# EAGLE schematic Nixie Clock (EAGLE 9.6.2)

## Sheet 1 of 5: Microcontroller
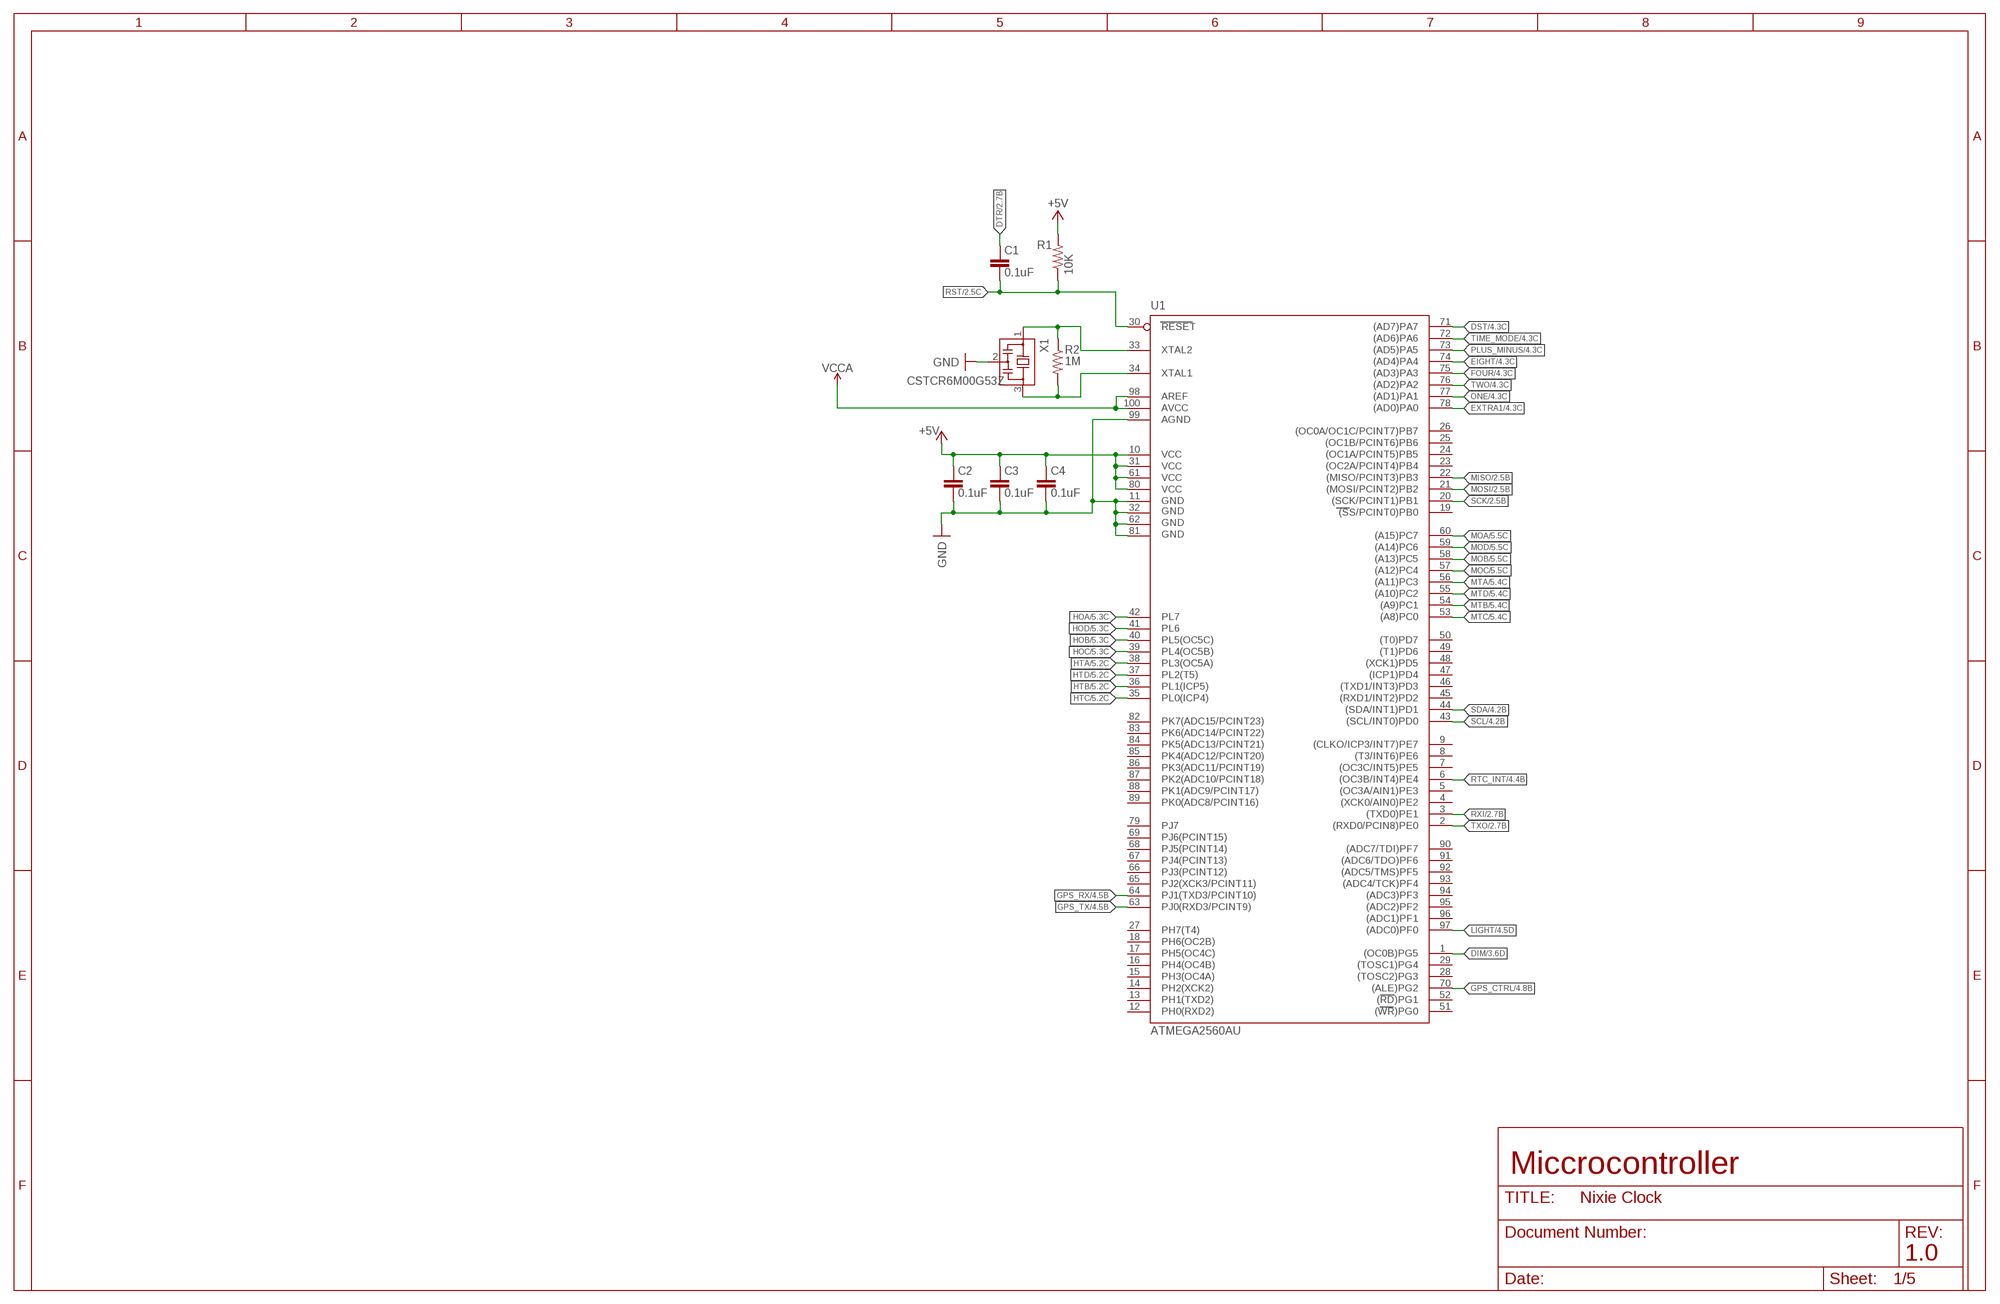
[diagram p0: schematic, sheet 1]

### Parts
C1  0.1uF  C-EUC0603  [C0603]
C2  0.1uF  C-EUC0603  [C0603]
C3  0.1uF  C-EUC0603  [C0603]
C4  0.1uF  C-EUC0603  [C0603]
R1  10K  R-US_R0603  [R0603]
R2  1M  R-US_R0603  [R0603]
U1  ATMEGA2560AU  [TQFP100]
X1  CSTCR6M00G53Z  [CSTCR6M]

### Nets
+5V: C2.1 C3.1 C4.1 R1.2 U1.10(VCC) U1.31(VCC1) U1.61(VCC2) U1.80(VCC3) ; also sheet 2,3,4,5
DIM: U1.1((OC0B)PG5) ; also sheet 3
DST: U1.71((AD7)PA7) ; also sheet 4
DTR: C1.1 ; also sheet 2
EIGHT: U1.74((AD4)PA4) ; also sheet 4
EXTRA1: U1.78((AD0)PA0) ; also sheet 4
FOUR: U1.75((AD3)PA3) ; also sheet 4
GND: C2.2 C3.2 C4.2 U1.11(GND) U1.32(GND1) U1.62(GND2) U1.81(GND3) U1.99(AGND) X1.2 ; also sheet 2,3,4,5
GPS_CTRL: U1.70((ALE)PG2) ; also sheet 4
GPS_RX: U1.64(PJ1(TXD3/PCINT10)) ; also sheet 4
GPS_TX: U1.63(PJ0(RXD3/PCINT9)) ; also sheet 4
HOA: U1.42(PL7) ; also sheet 5
HOB: U1.40(PL5(OC5C)) ; also sheet 5
HOC: U1.39(PL4(OC5B)) ; also sheet 5
HOD: U1.41(PL6) ; also sheet 5
HTA: U1.38(PL3(OC5A)) ; also sheet 5
HTB: U1.36(PL1(ICP5)) ; also sheet 5
HTC: U1.35(PL0(ICP4)) ; also sheet 5
HTD: U1.37(PL2(T5)) ; also sheet 5
LIGHT: U1.97((ADC0)PF0) ; also sheet 4
MISO: U1.22((MISO/PCINT3)PB3) ; also sheet 2
MOA: U1.60((A15)PC7) ; also sheet 5
MOB: U1.58((A13)PC5) ; also sheet 5
MOC: U1.57((A12)PC4) ; also sheet 5
MOD: U1.59((A14)PC6) ; also sheet 5
MOSI: U1.21((MOSI/PCINT2)PB2) ; also sheet 2
MTA: U1.56((A11)PC3) ; also sheet 5
MTB: U1.54((A9)PC1) ; also sheet 5
MTC: U1.53((A8)PC0) ; also sheet 5
MTD: U1.55((A10)PC2) ; also sheet 5
N$60: R2.2 U1.34(XTAL1) X1.3
N$61: R2.1 U1.33(XTAL2) X1.1
ONE: U1.77((AD1)PA1) ; also sheet 4
PLUS_MINUS: U1.73((AD5)PA5) ; also sheet 4
RST: C1.2 R1.1 U1.30(RESET) ; also sheet 2
RTC_INT: U1.6((OC3B/INT4)PE4) ; also sheet 4
RXI: U1.3((TXD0)PE1) ; also sheet 2
SCK: U1.20((SCK/PCINT1)PB1) ; also sheet 2
SCL: U1.43((SCL/INT0)PD0) ; also sheet 4
SDA: U1.44((SDA/INT1)PD1) ; also sheet 4
TIME_MODE: U1.72((AD6)PA6) ; also sheet 4
TWO: U1.76((AD2)PA2) ; also sheet 4
TXO: U1.2((RXD0/PCIN8)PE0) ; also sheet 2
VCCA: U1.98(AREF) U1.100(AVCC) ; also sheet 3,4
Unconnected: U1.4((XCK0/AIN0)PE2) U1.5((OC3A/AIN1)PE3) U1.7((OC3C/INT5)PE5) U1.8((T3/INT6)PE6) U1.9((CLKO/ICP3/INT7)PE7) U1.12(PH0(RXD2)) U1.13(PH1(TXD2)) U1.14(PH2(XCK2)) U1.15(PH3(OC4A)) U1.16(PH4(OC4B)) U1.17(PH5(OC4C)) U1.18(PH6(OC2B)) U1.19((SS/PCINT0)PB0) U1.23((OC2A/PCINT4)PB4) U1.24((OC1A/PCINT5)PB5) U1.25((OC1B/PCINT6)PB6) U1.26((OC0A/OC1C/PCINT7)PB7) U1.27(PH7(T4)) U1.28((TOSC2)PG3) U1.29((TOSC1)PG4) U1.45((RXD1/INT2)PD2) U1.46((TXD1/INT3)PD3) U1.47((ICP1)PD4) U1.48((XCK1)PD5) U1.49((T1)PD6) U1.50((T0)PD7) U1.51((WR)PG0) U1.52((RD)PG1) U1.65(PJ2(XCK3/PCINT11)) U1.66(PJ3(PCINT12)) U1.67(PJ4(PCINT13)) U1.68(PJ5(PCINT14)) U1.69(PJ6(PCINT15)) U1.79(PJ7) U1.82(PK7(ADC15/PCINT23)) U1.83(PK6(ADC14/PCINT22)) U1.84(PK5(ADC13/PCINT21)) U1.85(PK4(ADC12/PCINT20)) U1.86(PK3(ADC11/PCINT19)) U1.87(PK2(ADC10/PCINT18)) U1.88(PK1(ADC9/PCINT17)) U1.89(PK0(ADC8/PCINT16)) U1.90((ADC7/TDI)PF7) U1.91((ADC6/TDO)PF6) U1.92((ADC5/TMS)PF5) U1.93((ADC4/TCK)PF4) U1.94((ADC3)PF3) U1.95((ADC2)PF2) U1.96((ADC1)PF1)

### Notes on the sheet
- Miccrocontroller
- 1.0

## Sheet 2 of 5: Communication
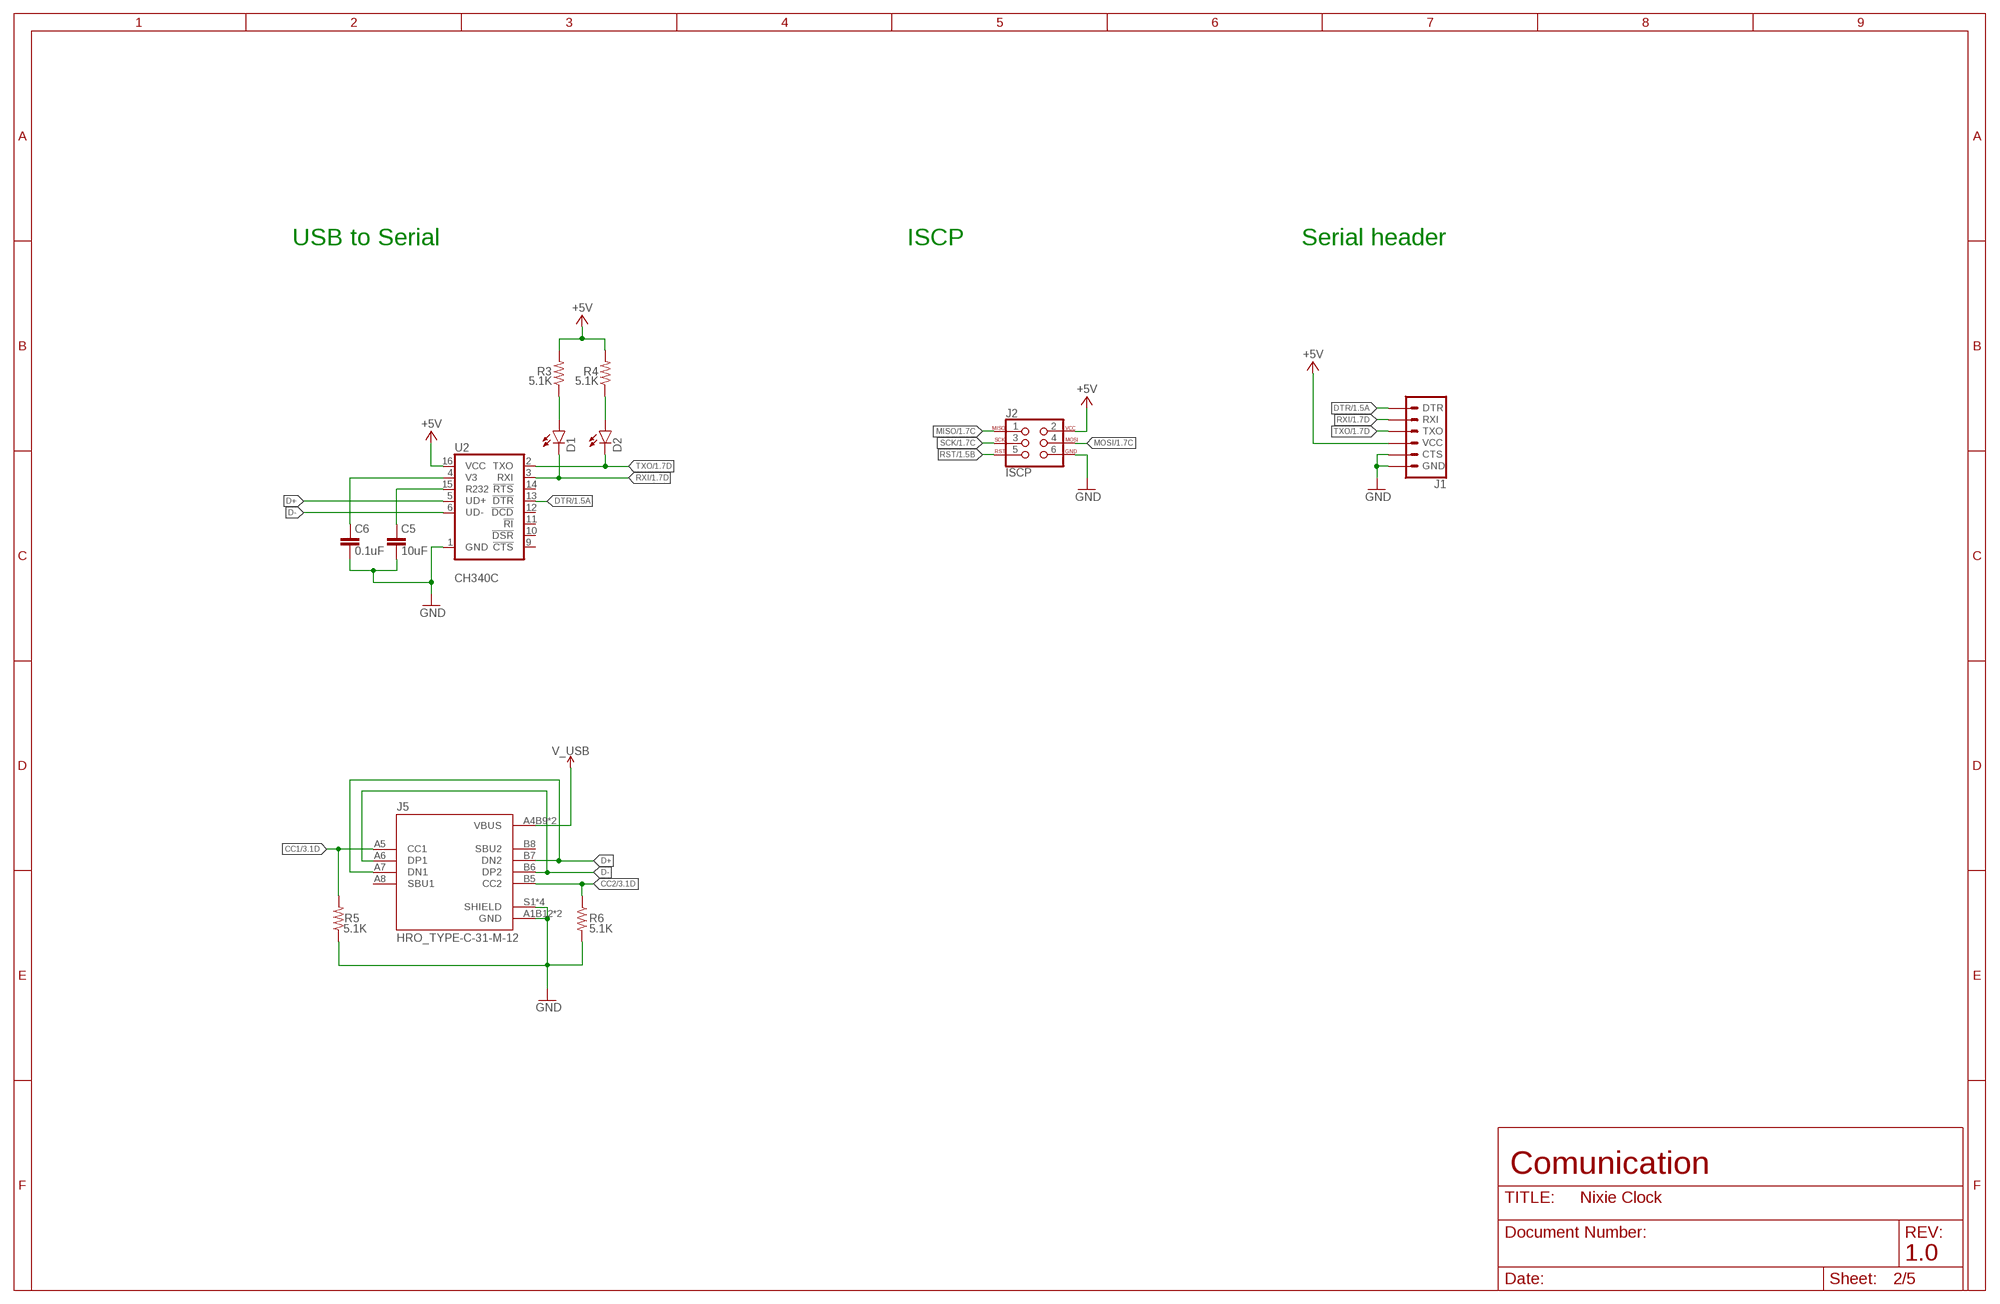
[diagram p1: schematic, sheet 2]

### Parts
C5  10uF  C-EUC0603  [C0603]
C6  0.1uF  C-EUC0603  [C0603]
D1  LEDCHIP-LED0603  [CHIP-LED0603]
D2  LEDCHIP-LED0603  [CHIP-LED0603]
J1  6_PIN_SERIAL_TARGETSILK  [6_PIN_SERIAL_TARGET_SIDE_W_SILK]
J2  ISCP  AVR_SPI_PROG_3X2PTH  [2X3]
J5  HRO_TYPE-C-31-M-12  [HRO_TYPE-C-31-M-12]
R3  5.1K  R-US_R0603  [R0603]
R4  5.1K  R-US_R0603  [R0603]
R5  5.1K  R-US_R0603  [R0603]
R6  5.1K  R-US_R0603  [R0603]
U2  CH340C  [SO016]

### Nets
+5V: J1.P$4(VCC) J2.2 R3.2 R4.2 U2.16(VCC) ; also sheet 1,3,4,5
CC1: J5.A5(CC1) R5.2 ; also sheet 3
CC2: J5.B5(CC2) R6.1 ; also sheet 3
D+: J5.A7(DN1) J5.B7(DN2) U2.5(UD+)
D-: J5.A6(DP1) J5.B6(DP2) U2.6(UD-)
DTR: J1.P$1(DTR) U2.13(!DTR) ; also sheet 1
GND: C5.2 C6.2 J1.P$5(CTS) J1.P$6(GND) J2.6 J5.A1B12(GND) J5.B1A12(GND) J5.S1(SHIELD) J5.S2(SHIELD) J5.S3(SHIELD) J5.S4(SHIELD) R5.1 R6.2 U2.1(GND) ; also sheet 1,3,4,5
MISO: J2.1 ; also sheet 1
MOSI: J2.4 ; also sheet 1
N$1: C5.1 U2.15(R232)
N$2: C6.1 U2.4(V3)
N$8: D1.A R3.1
N$9: D2.A R4.1
RST: J2.5 ; also sheet 1
RXI: D1.C J1.P$3(RXI) U2.3(RXI) ; also sheet 1
SCK: J2.3 ; also sheet 1
TXO: D2.C J1.P$2(TXO) U2.2(TXO) ; also sheet 1
V_USB: J5.A4B9(VBUS) J5.B4A9(VBUS) ; also sheet 3
Unconnected: J5.A8(SBU1) J5.B8(SBU2) U2.9(!CTS) U2.10(!DSR) U2.11(!RI) U2.12(!DCD) U2.14(!RTS)

### Notes on the sheet
- USB to Serial | ISCP | Serial header
- Comunication
- 1.0

## Sheet 3 of 5: Power
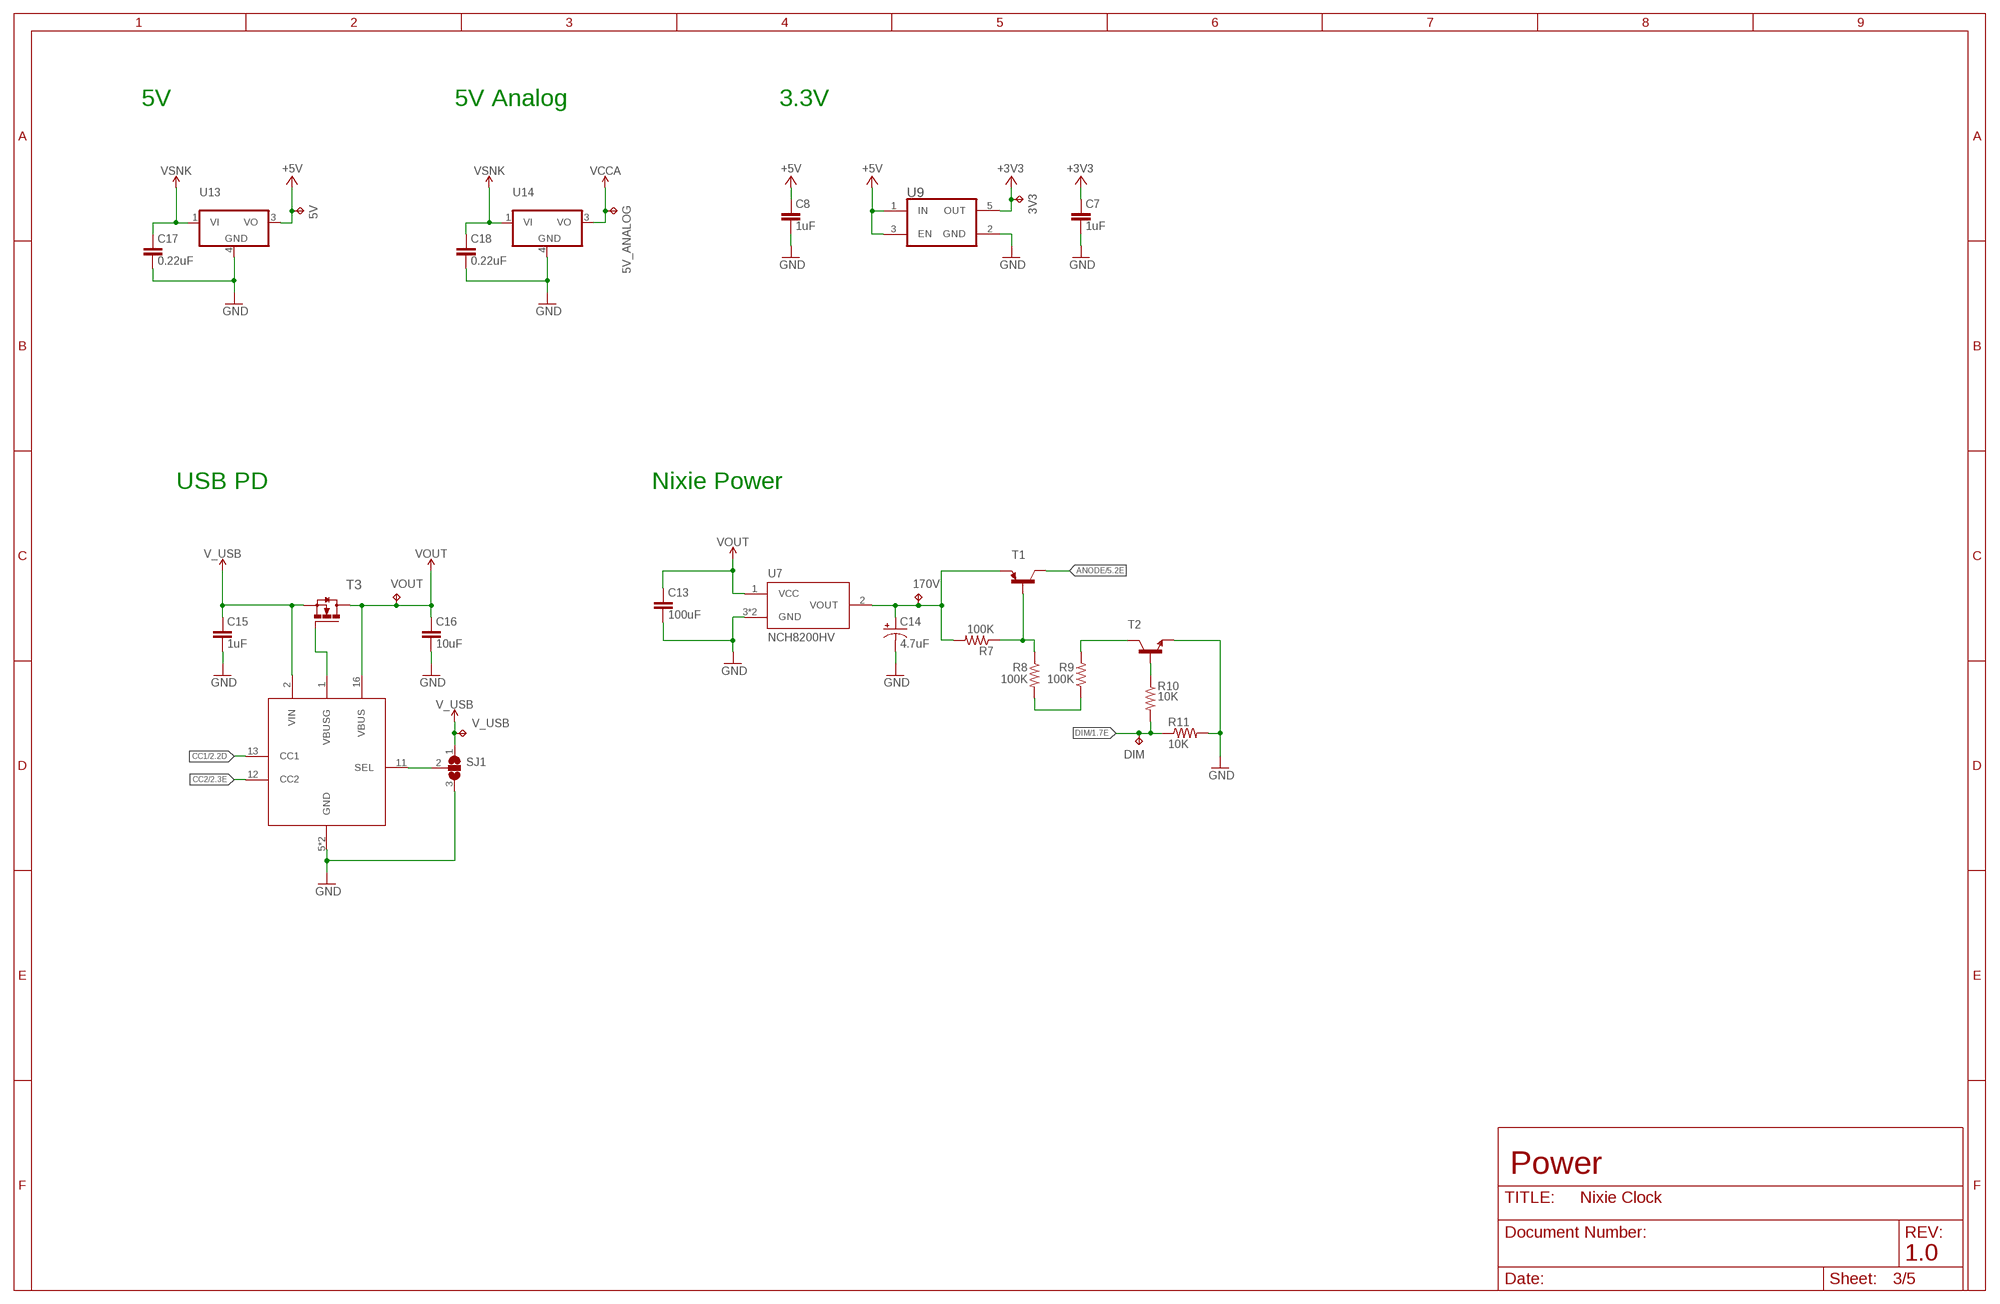
[diagram p2: schematic, sheet 3]

### Parts
3V3  TPPAD1-13  [P1-13]
5V  TPPAD1-13  [P1-13]
5V_ANALOG  TPPAD1-13  [P1-13]
170V  TPPAD1-13  [P1-13]
C7  1uF  C-EUC0603  [C0603]
C8  1uF  C-EUC0603  [C0603]
C13  100uF  C-EUC0603  [C0603]
C14  4.7uF  CPOL-USE3.5-8  [E3,5-8]
C15  1uF  C-EUC0603  [C0603]
C16  10uF  C-EUC0603  [C0603]
C17  0.22uF  C-EUC0603  [C0603]
C18  0.22uF  C-EUC0603  [C0603]
DIM  TPPAD1-13  [P1-13]
R7  100K  R-US_R0603  [R0603]
R8  100K  R-US_R0603  [R0603]
R9  100K  R-US_R0603  [R0603]
R10  10K  R-US_R0603  [R0603]
R11  10K  R-US_R0603  [R0603]
SJ1  SJ2W  [SJ_2]
T1  PZTA92  [SOT223]
T2  PZTA42  [SOT223]
T3  CSD18543Q3A  [VSONP-8]
U7  NCH8200HV  [NCH8200HV]
U9  MIC5504-3.3YM5TR  [SOT95P280X130-5N]
U12  IP2721  [TSSOP16EXP]
U13  LM340MP-05  [SOT223]
U14  LM340MP-05  [SOT223]
V_USB  TPPAD1-13  [P1-13]
VOUT  TPPAD1-13  [P1-13]

### Nets
+3V3: 3V3.TP C7.1 U9.5(OUT) ; also sheet 4
+5V: 5V.TP C8.1 U9.1(IN) U9.3(EN) U13.3(VO) ; also sheet 1,2,4,5
ANODE: T1.2(C) T1.4(C) ; also sheet 5
CC1: U12.13(CC1) ; also sheet 2
CC2: U12.12(CC2) ; also sheet 2
DIM: DIM.TP R10.2 R11.1 ; also sheet 1
GND: C7.2 C8.2 C13.2 C14.- C15.2 C16.2 C17.2 C18.2 R11.2 SJ1.3 T2.3(E) U7.3(GND) U7.4(GND) U9.2(GND) U12.5(GND) U12.EXP(GND) U13.4(GND) U14.4(GND) ; also sheet 1,2,4,5
N$3: T3.4(G) U12.1(VBUSG)
N$4: SJ1.2 U12.11(SEL)
N$6: R10.1 T2.1(B)
N$51: 170V.TP C14.+ R7.2 T1.3(E) U7.2(VOUT)
N$53: R7.1 R8.1 T1.1(B)
N$63: R9.2 T2.2(C) T2.4(C)
N$64: R8.2 R9.1
V_USB: C15.1 SJ1.1 T3.1(S) T3.2(S) T3.3(S) U12.2(VIN) V_USB.TP ; also sheet 2
VCCA: 5V_ANALOG.TP U14.3(VO) ; also sheet 1,4
VOUT: C13.1 C16.1 C17.1 C18.1 T3.5(D) T3.6(D) T3.7(D) T3.8(D) T3.9(D) T3.10(D) T3.11(D) T3.12(D) U7.1(VCC) U12.16(VBUS) U13.1(VI) U14.1(VI) VOUT.TP ; supply symbol labelled VSNK

### Notes on the sheet
- 5V | 5V Analog | 3.3V
- USB PD | Nixie Power
- Power
- 1.0

## Sheet 4 of 5: RTC and GPS
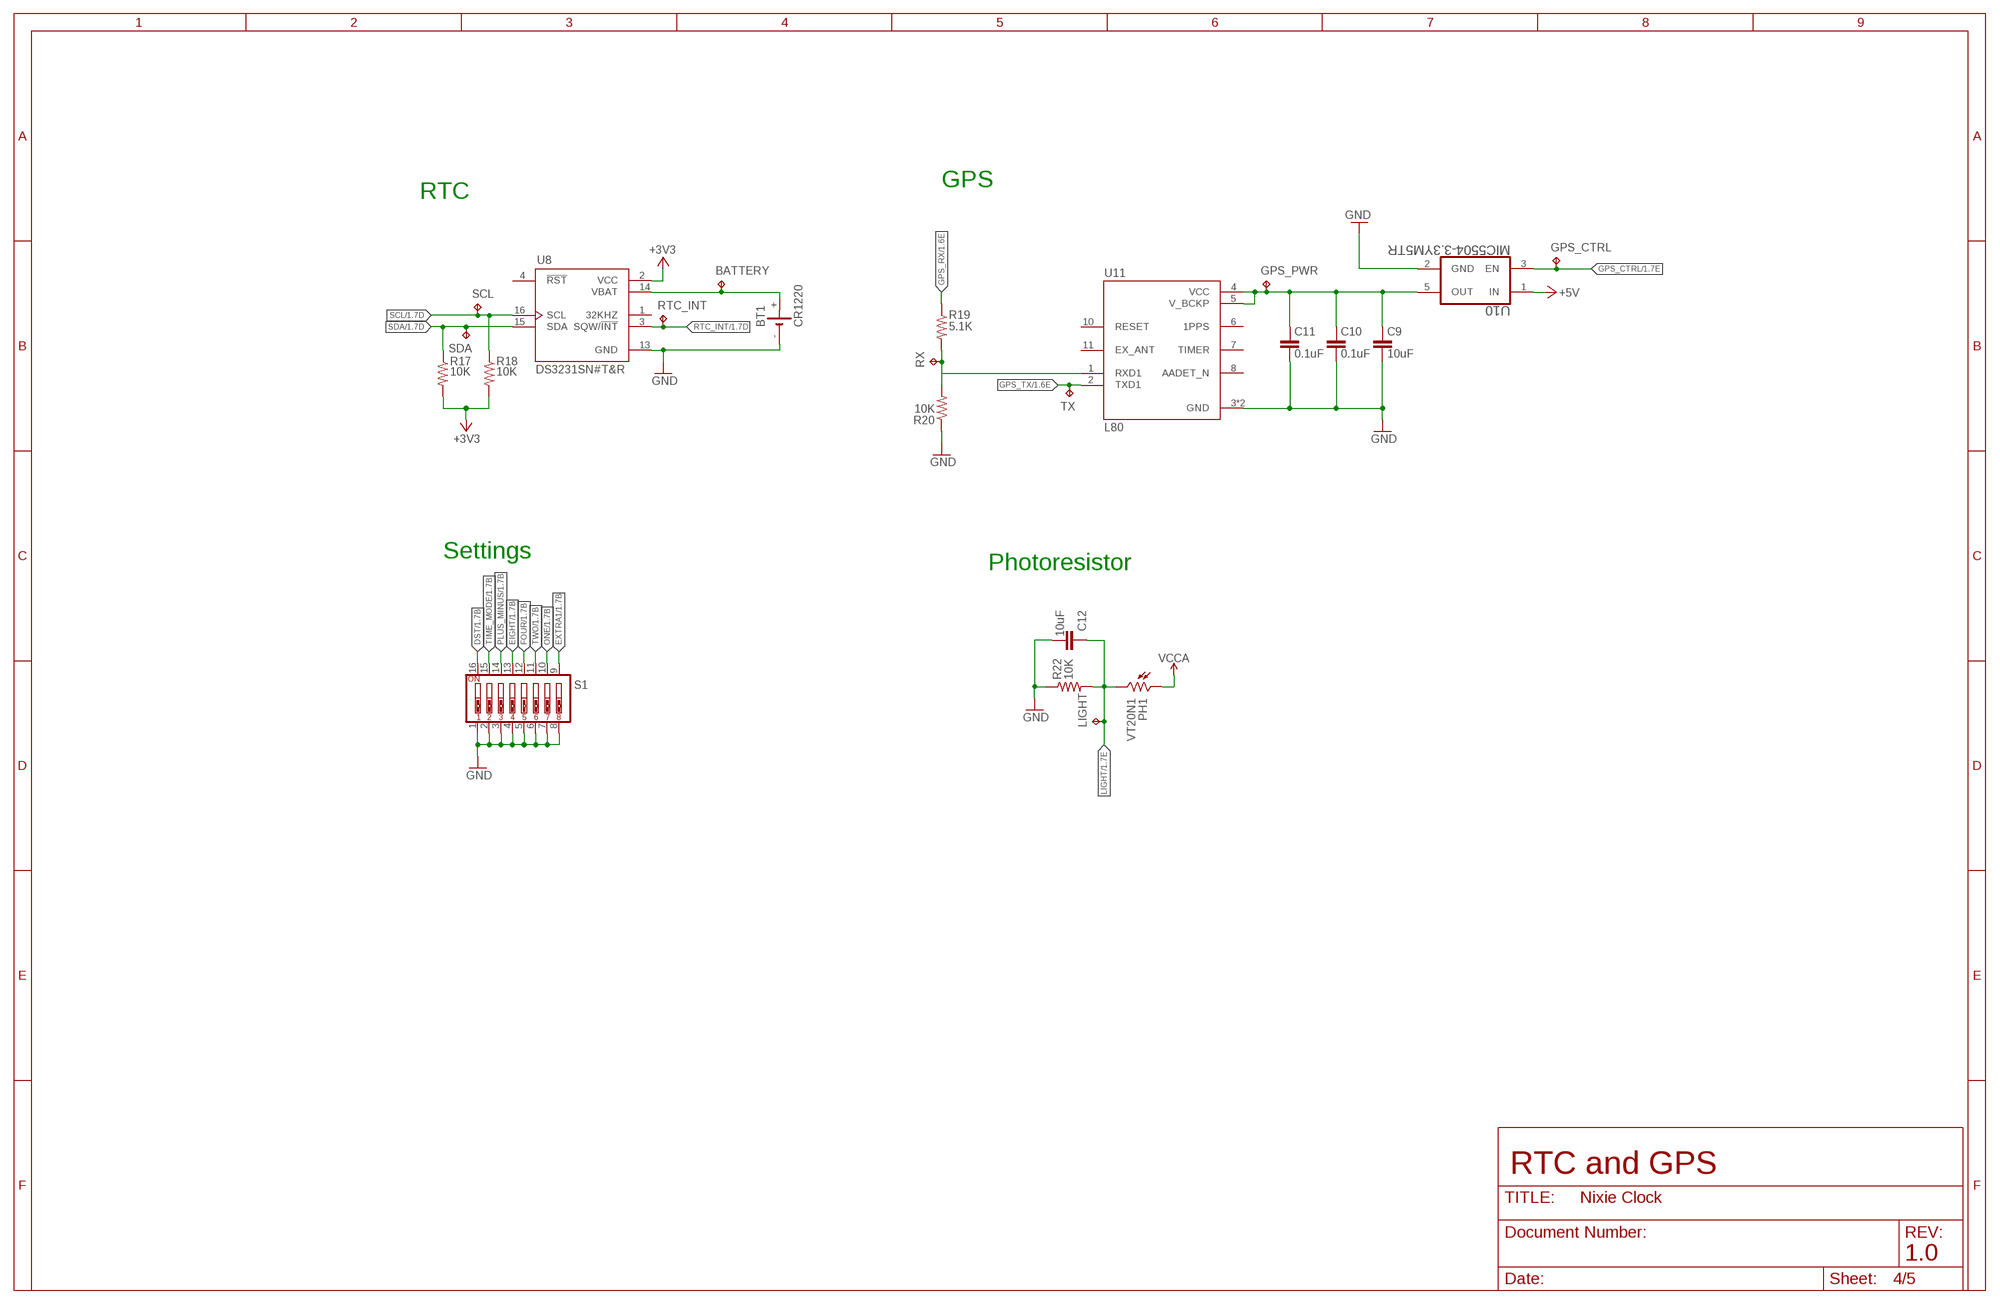
[diagram p3: schematic, sheet 4]

### Parts
BATTERY  TPPAD1-13  [P1-13]
BT1  CR1220  CH291-1220LF  [CH291-1220LF]
C9  10uF  C-EUC0603  [C0603]
C10  0.1uF  C-EUC0603  [C0603]
C11  0.1uF  C-EUC0603  [C0603]
C12  10uF  C-EUC0603  [C0603]
GPS_CTRL  TPPAD1-13  [P1-13]
GPS_PWR  TPPAD1-13  [P1-13]
LIGHT  TPPAD1-13  [P1-13]
PH1  VT20N1  [TO46-VT200]
R17  10K  R-US_R0603  [R0603]
R18  10K  R-US_R0603  [R0603]
R19  5.1K  R-US_R0603  [R0603]
R20  10K  R-US_R0603  [R0603]
R22  10K  R-US_R0603  [R0603]
RTC_INT  TPPAD1-13  [P1-13]
RX  TPPAD1-13  [P1-13]
S1  SW_DIP-8  [EDG-08]
SCL  TPPAD1-13  [P1-13]
SDA  TPPAD1-13  [P1-13]
TX  TPPAD1-13  [P1-13]
U8  DS3231SN#T&R  [SOIC127P1032X265-16N]
U10  MIC5504-3.3YM5TR  [SOT95P280X130-5N]
U11  L80  [XCVR_L80]

### Nets
+3V3: R17.2 R18.2 U8.2(VCC) ; also sheet 3
+5V: U10.1(IN) ; also sheet 1,2,3,5
DST: S1.16 ; also sheet 1
EIGHT: S1.13 ; also sheet 1
EXTRA1: S1.9 ; also sheet 1
FOUR: S1.12 ; also sheet 1
GND: BT1.- C9.2 C10.2 C11.2 C12.2 R20.1 R22.1 S1.1 S1.2 S1.3 S1.4 S1.5 S1.6 S1.7 S1.8 U8.13(GND) U10.2(GND) U11.3(GND) U11.12(GND) ; also sheet 1,2,3,5
GPS_CTRL: GPS_CTRL.TP U10.3(EN) ; also sheet 1
GPS_RX: R19.1 ; also sheet 1
GPS_TX: TX.TP U11.2(TXD1) ; also sheet 1
LIGHT: C12.1 LIGHT.TP PH1.2 R22.2 ; also sheet 1
N$55: BATTERY.TP BT1.+ U8.14(VBAT)
N$56: C9.1 C10.1 C11.1 GPS_PWR.TP U10.5(OUT) U11.4(VCC) U11.5(V_BCKP)
N$57: R19.2 R20.2 RX.TP U11.1(RXD1)
ONE: S1.10 ; also sheet 1
PLUS_MINUS: S1.14 ; also sheet 1
RTC_INT: RTC_INT.TP U8.3(SQW/!INT) ; also sheet 1
SCL: R18.1 SCL.TP U8.16(SCL) ; also sheet 1
SDA: R17.1 SDA.TP U8.15(SDA) ; also sheet 1
TIME_MODE: S1.15 ; also sheet 1
TWO: S1.11 ; also sheet 1
VCCA: PH1.1 ; also sheet 1,3
Unconnected: U8.1(32KHZ) U8.4(!RST) U11.6(1PPS) U11.7(TIMER) U11.8(AADET_N) U11.10(RESET) U11.11(EX_ANT)

### Notes on the sheet
- GPS
- RTC
- Settings
- Photoresistor
- RTC and GPS
- 1.0

## Sheet 5 of 5: Nixie Tubes and Drivers
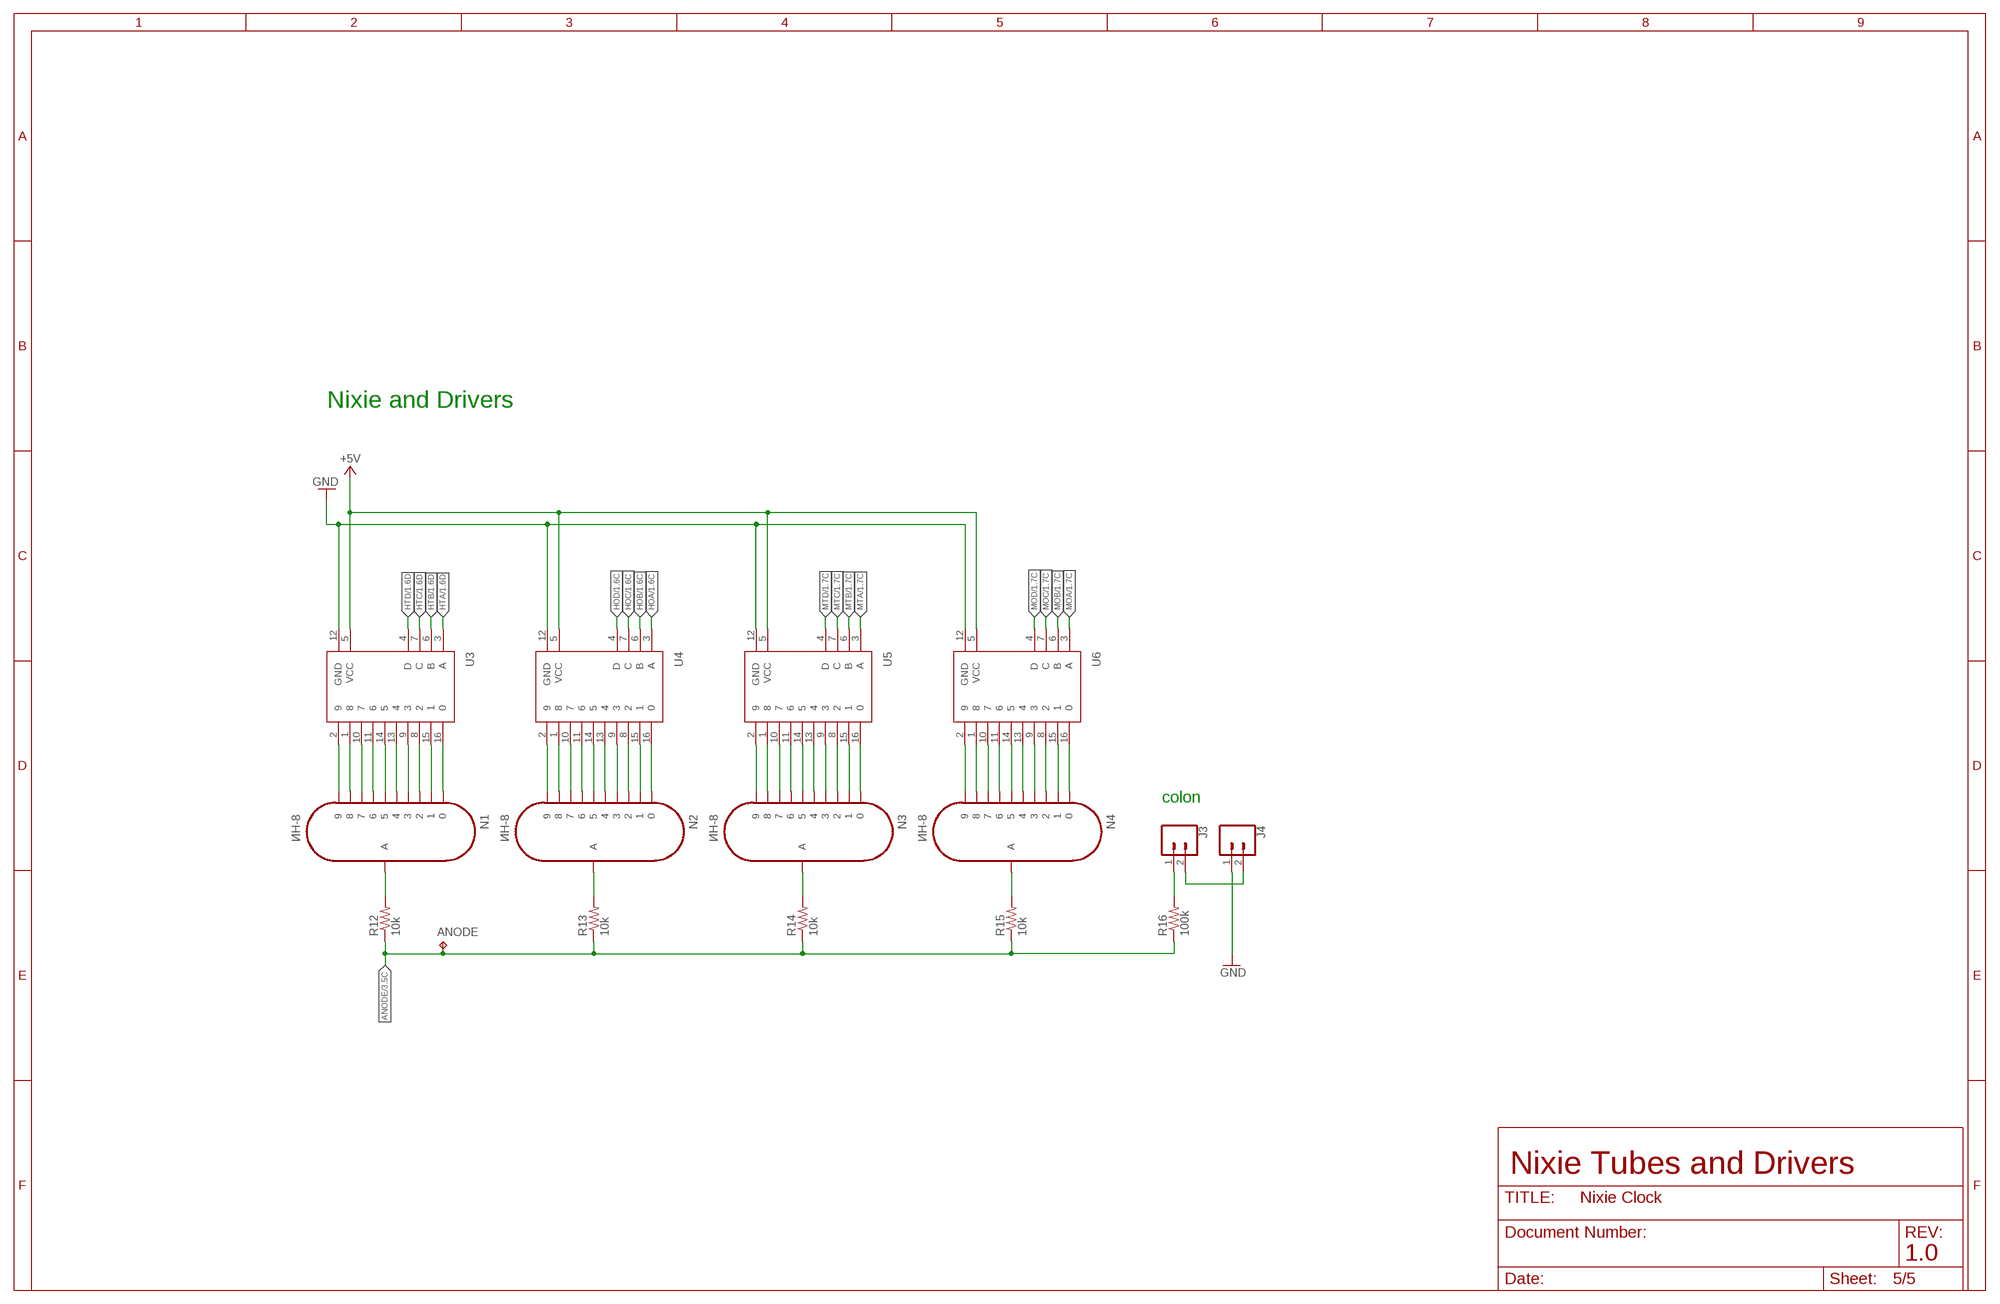
[diagram p4: schematic, sheet 5]

### Parts
ANODE  TPPAD1-13  [P1-13]
J3  CONN_02LOCK_LONGPADS  [1X02_LOCK_LONGPADS]
J4  CONN_02LOCK_LONGPADS  [1X02_LOCK_LONGPADS]
N1  ИН-8  IN-8IN-8_SOCKET  [IN-8_SOCKET]
N2  ИН-8  IN-8IN-8_SOCKET  [IN-8_SOCKET]
N3  ИН-8  IN-8IN-8_SOCKET  [IN-8_SOCKET]
N4  ИН-8  IN-8IN-8_SOCKET  [IN-8_SOCKET]
R12  10k  R-US_M0805  [M0805]
R13  10k  R-US_M0805  [M0805]
R14  10k  R-US_M0805  [M0805]
R15  10k  R-US_M0805  [M0805]
R16  100k  R-US_R0603  [R0603]
U3  K155ID1  [DIL16-KIT]
U4  K155ID1  [DIL16-KIT]
U5  K155ID1  [DIL16-KIT]
U6  K155ID1  [DIL16-KIT]

### Nets
+5V: U3.5(VCC) U4.5(VCC) U5.5(VCC) U6.5(VCC) ; also sheet 1,2,3,4
ANODE: ANODE.TP R12.1 R13.1 R14.1 R15.1 R16.1 ; also sheet 3
GND: J4.1 U3.12(GND) U4.12(GND) U5.12(GND) U6.12(GND) ; also sheet 1,2,3,4
HOA: U4.3(A) ; also sheet 1
HOB: U4.6(B) ; also sheet 1
HOC: U4.7(C) ; also sheet 1
HOD: U4.4(D) ; also sheet 1
HTA: U3.3(A) ; also sheet 1
HTB: U3.6(B) ; also sheet 1
HTC: U3.7(C) ; also sheet 1
HTD: U3.4(D) ; also sheet 1
MOA: U6.3(A) ; also sheet 1
MOB: U6.6(B) ; also sheet 1
MOC: U6.7(C) ; also sheet 1
MOD: U6.4(D) ; also sheet 1
MTA: U5.3(A) ; also sheet 1
MTB: U5.6(B) ; also sheet 1
MTC: U5.7(C) ; also sheet 1
MTD: U5.4(D) ; also sheet 1
N$5: J3.1 R16.2
N$7: J3.2 J4.2
N$16: N1.9 U3.2
N$17: N1.8 U3.1
N$18: N1.7 U3.10
N$19: N1.6 U3.11
N$20: N1.5 U3.14
N$21: N1.4 U3.13
N$22: N1.3 U3.9
N$23: N1.2 U3.8
N$24: N1.1 U3.15
N$25: N1.0 U3.16
N$26: N1.A R12.2
N$27: N2.9 U4.2
N$28: N2.8 U4.1
N$29: N2.7 U4.10
N$30: N2.6 U4.11
N$31: N2.5 U4.14
N$32: N2.4 U4.13
N$33: N2.3 U4.9
N$34: N2.2 U4.8
N$35: N2.1 U4.15
N$36: N2.0 U4.16
N$37: N2.A R13.2
N$62: N3.9 U5.2
N$65: N3.8 U5.1
N$66: N3.7 U5.10
N$67: N3.6 U5.11
N$68: N3.5 U5.14
N$69: N3.4 U5.13
N$70: N3.3 U5.9
N$71: N3.2 U5.8
N$72: N3.1 U5.15
N$73: N3.0 U5.16
N$74: N3.A R14.2
N$86: N4.9 U6.2
N$87: N4.8 U6.1
N$88: N4.7 U6.10
N$89: N4.6 U6.11
N$90: N4.5 U6.14
N$91: N4.4 U6.13
N$92: N4.3 U6.9
N$93: N4.2 U6.8
N$94: N4.1 U6.15
N$95: N4.0 U6.16
N$96: N4.A R15.2

### Notes on the sheet
- Nixie and Drivers
- colon
- Nixie Tubes and Drivers
- 1.0

## Library data of the parts
3V3 5V 5V_ANALOG 170V ANODE BATTERY DIM GPS_CTRL GPS_PWR LIGHT RTC_INT RX SCL SDA TX V_USB VOUT = testpad:TP: Test pad
BT1 = battery:CH291-1220LF: Battery Holder, SMT, 12mm multicomp PART NO. CH291-1220LF Source: Data sheet <http://www.farnell.com/datasheets/1505860.pdf>
C1-C13 C15-C18 = rcl:C-EU: CAPACITOR, European symbol; SPICEPREFIX: C
C14 = rcl:CPOL-US: POLARIZED CAPACITOR, American symbol; SPICEPREFIX: C
D1 D2 = led:LED: LED OSRAM: - CHIPLED LG R971, LG N971, LY N971, LG Q971, LY Q971, LO R971, LY R971 LH N974, LH R974 LS Q976, LO Q976, LY Q976 LO Q996 - Hyper CHIPLED LW Q18S LB Q993, LB Q99A, LB R99A - SideLED LS A670, LO A670, LY A670, LG A670, LP A670 LB A673, LV A673, LT A673, LW A673 LH A674 LY A675 LS A676, LA A676, LO A676, LY A676, LW A676 LS A679, LY A679, LG A679 - Hyper Micro SIDELED® LS Y876, LA Y876, LO Y876, LY Y876 LT Y87S - SmartLED LW L88C, LW L88S LB L89C, LB L89S, LG L890 LS L89K, LO L89K, LY L89K LS L896, LA L896, LO L896, LY L896 - TOPLED LS T670, LO T670, LY T670, LG T670, LP T670 LSG T670, LSP T670, LSY T670, LOP T670, LYG T670 LG T671, LOG T671, LSG T671 LB T673, LV T673, LT T673, LW T673 LH T674 LS T676, LA T676, LO T676, LY T676, LB T676, LH T676, LSB T676, LW T676 LB T67C, LV T67C, LT T67C, LS T67K, LO T67K, LY T67K, LW E67C LS E67B, LA E67B, LO E67B, LY E67B, LB E67C, LV E67C, LT E67C LW T67C LS T679, LY T679, LG T679 LS T770, LO T770, LY T770, LG T770, LP T770 LB T773, LV T773, LT T773, LW T773 LH T774 LS E675, LA E675, LY E675, LS T675 LS T776, LA T776, LO T776, LY T776, LB T776 LHGB T686 LT T68C, LB T68C - Hyper Mini TOPLED® LB M676 - Mini TOPLED Santana® LG M470 LS M47K, LO M47K, LY M47K Source: http://www.osram.convergy.de LUXEON: - LUMILED® LXK2-PW12-R00, LXK2-PW12-S00, LXK2-PW14-U00, LXK2-PW14-V00 LXK2-PM12-R00, LXK2-PM12-S00, LXK2-PM14-U00 LXK2-PE12-Q00, LXK2-PE12-R00, LXK2-PE12-S00, LXK2-PE14-T00, LXK2-PE14-U00 LXK2-PB12-K00, LXK2-PB12-L00, LXK2-PB12-M00, LXK2-PB14-N00, LXK2-PB14-P00, LXK2-PB14-Q00 LXK2-PR12-L00, LXK2-PR12-M00, LXK2-PR14-Q00, LXK2-PR14-R00 LXK2-PD12-Q00, LXK2-PD12-R00, LXK2-PD12-S00 LXK2-PH12-R00, LXK2-PH12-S00 LXK2-PL12-P00, LXK2-PL12-Q00, LXK2-PL12-R00 Source: www.luxeon.com KINGBRIGHT: KA-3528ASYC Source: www.kingbright.com
J1 = SparkFun-Connectors:6_PIN_SERIAL_TARGET: 6-pin header connection for use with the "FTDI BASIC" pinout - TARGET SIDE. Also known as "Arduino Serial Program Header". It is used to mate with our FTDI Basic serial programmers using the Arduino IDE. Note, this device has "TARGET" in the name. It is intended to be used on a design that contains a target micro-controller that you wish to program. The "sister" device, named "CABLE" is inteneded to be used on a design that usually lives on the end of your USB cable and prvides the converter chip (FTDI232 or FTDI231x) to commnicate serial RX/TX. You can populate with some of these: Break Away Headers - Straight <https://www.sparkfun.com/products/116> (PRT-00116) For reference (or to suit your programming needs) check out these designs: SparkFun FTDI Basic Breakout - 5V <https://www.sparkfun.com/products/9716> (DEV-09716) SparkFun FTDI Basic Breakout - 3.3V <https://www.sparkfun.com/products/9873> (DEV-09873) SparkFun FTDI SmartBasic <https://www.sparkfun.com/products/12935> (DEV-12935) SparkFun Beefy 3 - FTDI Basic Breakout <https://www.sparkfun.com/products/13746> (DEV-13746)
J2 = SparkFun-Connectors:AVR_SPI_PROG_3X2: AVR ISP 6 Pin This is the reduced ISP connector for AVR programming. Common on Arduino. This footprint will take up less PCB space and can be used with a 10-pin to 6-pin adapter such as SKU: BOB-08508 **Special note about "TEST_POINT" package. The stop mask is on the top side, so if you want your programming test points to be on the bottom of your board, make sure to place this package on the bottom side of the board. This also ensure that the orientation to program from the bottom side will be correct. SparkFun Products: SparkFun ISP Pogo Adapter <https://www.sparkfun.com/products/11591> - NS Tiny AVR Programmer <https://www.sparkfun.com/products/11801> -PTH
J3 J4 = SparkFun-Connectors:CONN_02: Multi connection point. Often used as Generic Header-pin footprint for 0.1 inch spaced/style header connections On any of the 0.1 inch spaced packages, you can populate with these: Break Away Headers - Straight <https://www.sparkfun.com/products/116> (PRT-00116) Break Away Male Headers - Right Angle <https://www.sparkfun.com/products/553> (PRT-00553) Female Headers <https://www.sparkfun.com/products/115> (PRT-00115) Break Away Headers - Machine Pin <https://www.sparkfun.com/products/117> (PRT-00117) Break Away Female Headers - Swiss Machine Pin <https://www.sparkfun.com/products/743> (PRT-00743) For SCREWTERMINALS and SPRING TERMINALS visit here: Screw Terimnals on SparkFun.com <https://www.sparkfun.com/search/results?term=Screw+Terminals> (5mm/3.5mm/2.54mm spacing) This device is also useful as a general connection point to wire up your design to another part of your project. Our various solder wires solder well into these plated through hole pads. Hook-Up Wire - Assortment (Stranded, 22 AWG) <https://www.sparkfun.com/products/11375> (PRT-11375) Hook-Up Wire - Assortment (Solid Core, 22 AWG) <https://www.sparkfun.com/products/11367> (PRT-11367) View the entire wire category on our website here <https://www.sparkfun.com/categories/141> Special notes: Molex polarized connector foot print use with: PRT-08233 with associated crimp pins and housings. 2.54_SCREWTERM for use with PRT-10571. 3.5mm Screw Terminal footprints for PRT-08084 5mm Screw Terminal footprints for use with PRT-08432
J5 = My Components:HRO_TYPE-C-31-M-12: USB Connectors 24 Receptacle 1 8.94*7.3mm RoHS; AVAILABILITY: Unavailable; DESCRIPTION: USB Connectors 24 Receptacle 1 8.94*7.3mm RoHS; MF: HRO Electronics Co., Ltd.; MP: TYPE-C-31-M-12; PACKAGE: Package; PRICE: None
N1-N4 = russian-nixies:IN-8
PH1 = photo-elements:VT2*: Photoconductive Cell VT200 Series Source: http://optoelectronics.perkinelmer.com/content/Datasheets/DTS_vt200seriesdatasheet.pdf
R1-R20 R22 = rcl:R-US_: RESISTOR, American symbol; SPICEPREFIX: R
S1 = special:SW_DIP-8: DIP SWITCH
SJ1 = jumper:SJ2W: SMD solder JUMPER
T1 = My Components:PZTA92
T2 = My Components:PZTA42
T3 = My Components:CSD18543Q3A; MFR: TI; MPN: CSD18543Q3A
U1 = SparkFun-IC-Microcontroller:ATMEGA2560: Atmel 100-pin 8-bit uC 64/128/256 Kbytes FLASH 4 Kbytes EEPROM 8 Kbytes SRAM 86 General Purpose I/O pins 12-channels16-bit PWM 4 x Serial USARTs 16-channels 10-bit A/D SparkFun Products None.; MPN: ATMEGA2560-16AU; PROD_ID: IC-10040
U2 = SparkFun-IC-Comms:CH340C; MPN: CH340C; PROD_ID: IC-14038
U3-U6 = russian-nixies:K155ID1
U7 = My Components:NCH8200HV
U8 = My Components:DS3231SN#T&R: Real Time Clock Serial 16-Pin SOIC W T/R; AVAILABILITY: Unavailable; DESCRIPTION: Real Time Clock _RTC_ IC Clock/Calendar I²C, 2-Wire Serial 16-SOIC _0.295, 7.50mm Width_; MF: Maxim Integrated; MP: DS3231SN#T&amp;R; PACKAGE: SOIC-16 Maxim; PRICE: None
U9 U10 = My Components:MIC5504-3.3YM5TR; MPN: MIC5504-3.3YM5-TR
U11 = My Components:L80; AVAILABILITY: Unavailable; DESCRIPTION: L80 is an ultra compact GPS POT _Patch on Top_ module with an embedded 15.0mm × 15.0mm × 4.0mm patch antenna.; MF: Quectel; MP: L80-M39; PACKAGE: Radial Can Quectel; PRICE: None
U12 = My Components:IP2721
U13 = linear:LM340?-*: Positive VOLTAGE REGULATOR Source: http://cache.national.com/ds/LM/LM340.pdf; MFR: TI; MPN: LM340MP-5.0/NOPB
U14 = linear:LM340?-*: Positive VOLTAGE REGULATOR Source: http://cache.national.com/ds/LM/LM340.pdf; MFN: TI; MON: LM340MP-5.0/NOPB
X1 = murata-filter:CSTCR: Resonator Source: murata.co.jp; MPN: CSTCE16M0V13C99-R0; OC_FARNELL: 1170434; OC_NEWARK: 25M8759